# Altium project PCB_Project.PrjPcb
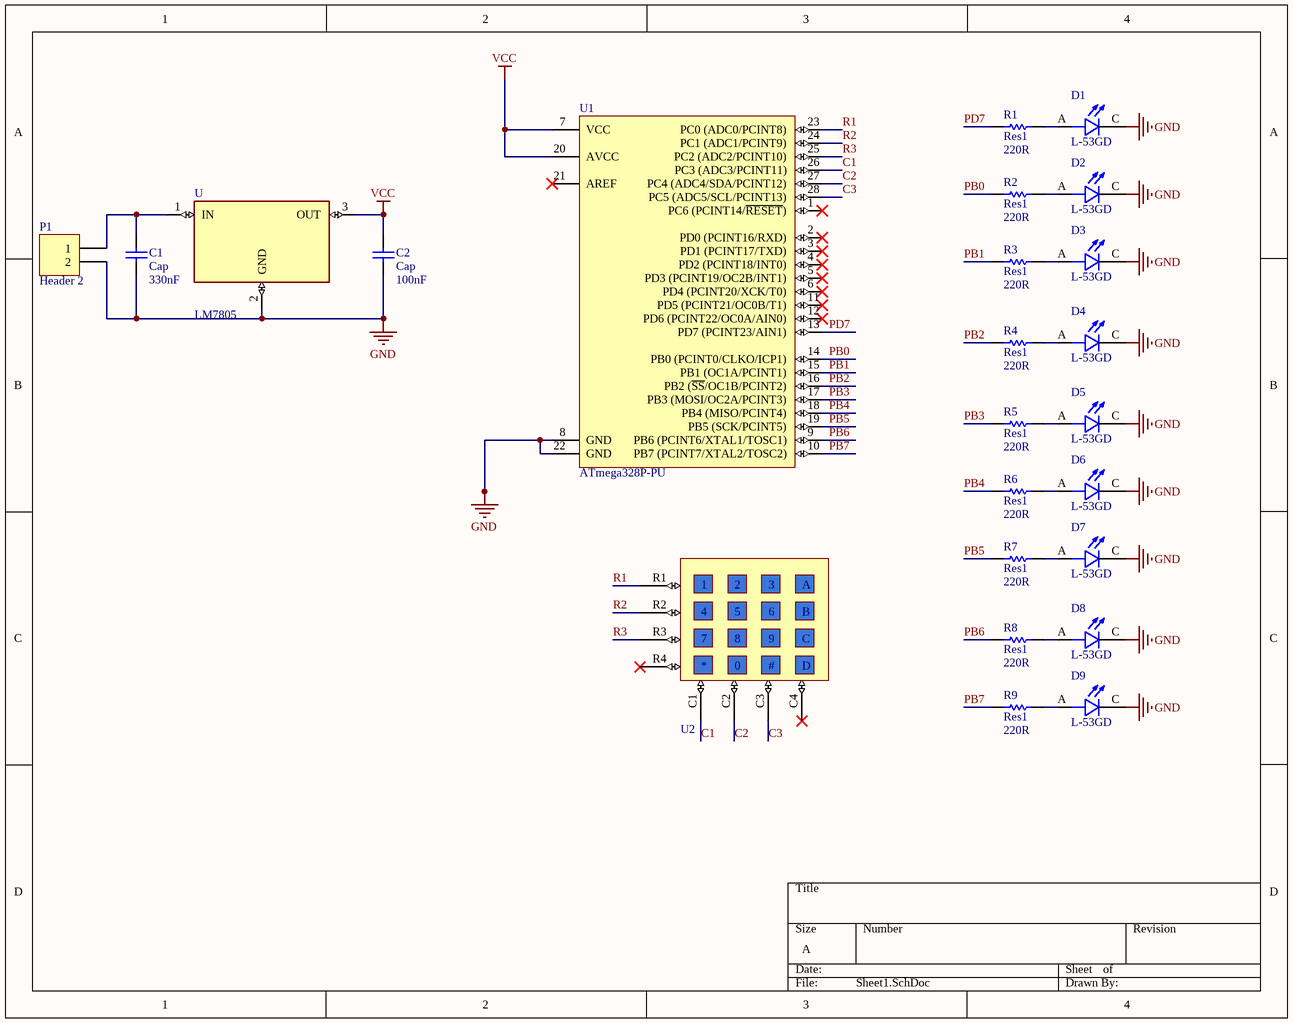
[diagram p0: Sheet1.SchDoc]
1 sheet, 24 parts. Net scope: global (net labels, ports and power ports of the same name join across sheets).
Board file: PCB1.PcbDoc

## Sheet Sheet1.SchDoc
size A

### Parts
C1  Cap  value 330nF  [RAD-0.3]
C2  Cap  value 100nF  [RAD-0.3]
D1  L-53GD  [LEDRD254W50D500H1060]
D2  L-53GD  [LEDRD254W50D500H1060]
D3  L-53GD  [LEDRD254W50D500H1060]
D4  L-53GD  [LEDRD254W50D500H1060]
D5  L-53GD  [LEDRD254W50D500H1060]
D6  L-53GD  [LEDRD254W50D500H1060]
D7  L-53GD  [LEDRD254W50D500H1060]
D8  L-53GD  [LEDRD254W50D500H1060]
D9  L-53GD  [LEDRD254W50D500H1060]
P1  Header 2  [HDR1X2]
R1  Res1  value 220R  [AXIAL-0.3]
R2  Res1  value 220R  [AXIAL-0.3]
R3  Res1  value 220R  [AXIAL-0.3]
R4  Res1  value 220R  [AXIAL-0.3]
R5  Res1  value 220R  [AXIAL-0.3]
R6  Res1  value 220R  [AXIAL-0.3]
R7  Res1  value 220R  [AXIAL-0.3]
R8  Res1  value 220R  [AXIAL-0.3]
R9  Res1  value 220R  [AXIAL-0.3]
U  LM7805  [TO220]
U1  ATmega328P-PU  [28P3]
U2  keypad 4*3  [keypad 4*4]  (value not drawn)

### Nets
GND: C1.1 C2.1 D1.C D2.C D3.C D4.C D5.C D6.C D7.C D8.C D9.C P1.2 U.2(GND) U1.8(GND) U1.22(GND)
VCC: C2.2 U.3(OUT) U1.7(VCC) U1.20(AVCC)
C1: U1.26(PC3_(ADC3/PCINT11)) U2.C1
C2: U1.27(PC4_(ADC4/SDA/PCINT12)) U2.C2
C3: U1.28(PC5_(ADC5/SCL/PCINT13)) U2.C3
PB0: R2.1 U1.14(PB0_(PCINT0/CLKO/ICP1))
PB1: R3.1 U1.15(PB1_(OC1A/PCINT1))
PB2: R4.1 U1.16(PB2_(~{SS}/OC1B/PCINT2))
PB3: R5.1 U1.17(PB3_(MOSI/OC2A/PCINT3))
PB4: R6.1 U1.18(PB4_(MISO/PCINT4))
PB5: R7.1 U1.19(PB5_(SCK/PCINT5))
PB6: R8.1 U1.9(PB6_(PCINT6/XTAL1/TOSC1))
PB7: R9.1 U1.10(PB7_(PCINT7/XTAL2/TOSC2))
PD7: R1.1 U1.13(PD7_(PCINT23/AIN1))
R1: U1.23(PC0_(ADC0/PCINT8)) U2.R1
R2: U1.24(PC1_(ADC1/PCINT9)) U2.R2
R3: U1.25(PC2_(ADC2/PCINT10)) U2.R3
NetC1_2: C1.2 P1.1 U.1(IN)
NetD1_A: D1.A R1.2
NetD2_A: D2.A R2.2
NetD3_A: D3.A R3.2
NetD4_A: D4.A R4.2
NetD5_A: D5.A R5.2
NetD6_A: D6.A R6.2
NetD7_A: D7.A R7.2
NetD8_A: D8.A R8.2
NetD9_A: D9.A R9.2

Not connected (* = marked no-connect by the designer): U1 1(PC6_(PCINT14/~{RESET}))* 2(PD0_(PCINT16/RXD))* 3(PD1_(PCINT17/TXD))* 4(PD2_(PCINT18/INT0))* 5(PD3_(PCINT19/OC2B/INT1))* 6(PD4_(PCINT20/XCK/T0))* 11(PD5_(PCINT21/OC0B/T1))* 12(PD6_(PCINT22/OC0A/AIN0))* 21(AREF)*; U2 C4(R5)* R4(36)*

### Notes on the sheet
- (in symbol keypad 4*3) 2; 3; A; 4; 5; 6; B; 7; 8; 9; C; 0; #; D

### Library data of the parts
C1 C2 = Cap: Capacitor; Published: 8-Jun-2000; LatestRevisionDate: 17-Jul-2002; LatestRevisionNote: Re-released for DXP Platform.; PackageReference: RAD-0.3; Publisher: Altium Limited; PackageDescription: Radial Cap, Thru-Hole; 2 Leads; 0.3 in Pin Spacing
D1-D9 = L-53GD: LED; 5mm; green; 5-32mcd; 60Â°; Front: convex; MF: Kingbright; Availability: Unavailable; SnapEDA_Link: https://www.snapeda.com/parts/L-53GD/Kingbright/view-part/525636/?ref=snap; Price: None; Package: CDIP-28 Kingbright; MP: L-53GD; Value: *
P1 = Header 2: Header, 2-Pin; LatestRevisionDate: 17-Jul-2002; LatestRevisionNote: Re-released for DXP Platform.; Publisher: Altium Limited
R1-R9 = Res1: Resistor; Published: 8-Jun-2000; LatestRevisionDate: 17-Jul-2002; LatestRevisionNote: Re-released for DXP Platform.; PackageReference: AXIAL-0.3; Publisher: Altium Limited; PackageDescription: Axial Device, Thru-Hole; 2 Leads; 0.3 in Pin Spacing
U = LM7805: Linear Voltage Regulator IC 1 Output 1.5A SOT-223-4; MF: Texas Instruments; Availability: Unavailable; SnapEDA_Link: https://www.snapeda.com/parts/LM7805/Texas%20Instruments/view-part/2302466/?ref=snap; MP: LM7805; Price: None; Value: *; Package: TO-220 Texas Instruments
U1 = CMP-0095-00013-2: 8-bit AVR Microcontroller, 32KB Flash, 1KB EEPROM, 2KB SRAM, 28-pin PDIP, Industrial Grade (-40°C to 85°C); RevisionNote: DatasheetVersion updated. URLs added.; PackageVersion: revB, Sep-2001; PackageDescription: 28-lead (0.300"/7.62mm Wide) Plastic Dual Inline Package (PDIP); DatasheetVersion: revD, May-2011; ComponentLink1Description: Manufacturer URL; ComponentLink1URL: http://www.atmel.com/; PackageReference: 28P3; ComponentLink2Description: ATmega48A/48PA/88A/88PA/168A/168PA/328/328P Datasheet; ComponentLink3URL: http://www.atmel.com/dyn/resources/prod_documents/8271S.pdf; ComponentLink2URL: http://www.atmel.com/dyn/resources/prod_documents/8271.pdf; ComponentLink3Description: ATmega48A/48PA/88A/88PA/168A/168PA/328/328P Summary